# Altium schematic sheet RS485.SchDoc
size A4; Organization: Altium Limited; Address1: L3, 12a Rodborough Rd; Address2: Frenchs Forest; Address3: NSW; Address4: Australia 2086
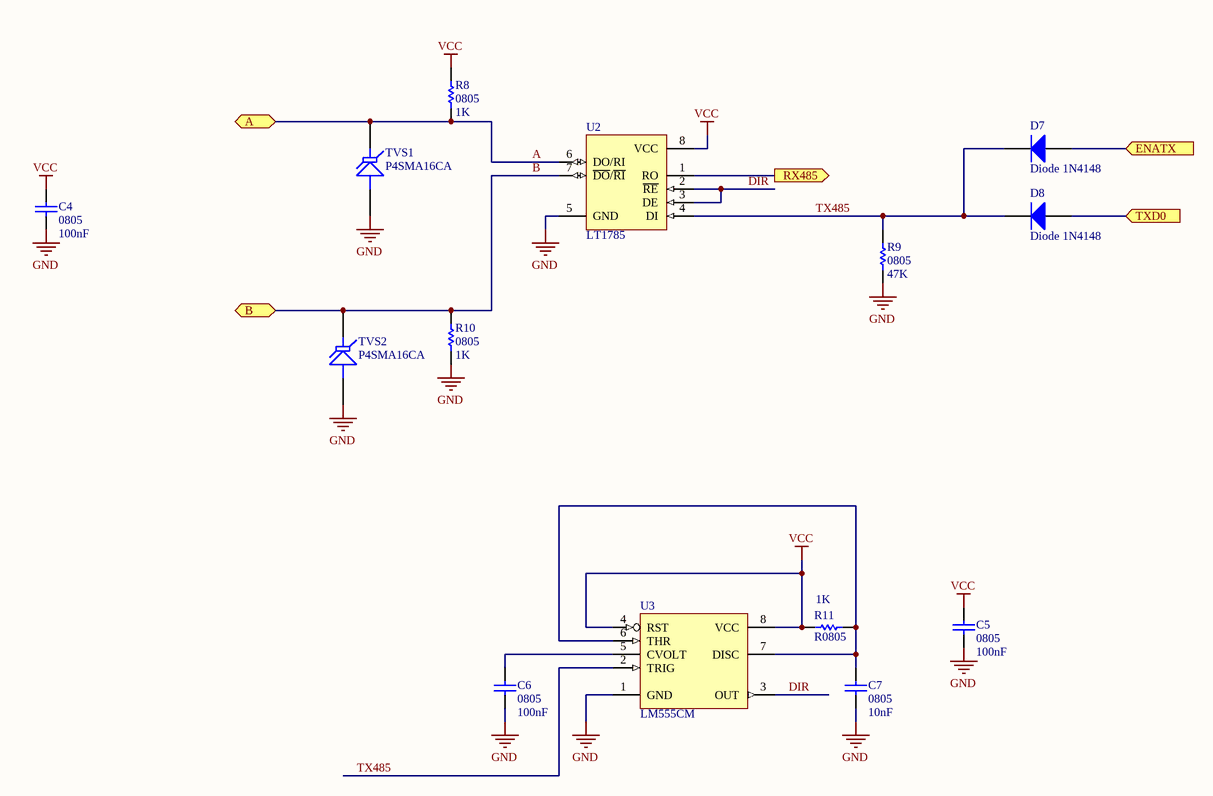
[diagram p0: RS485.SchDoc]

## Parts
C4  0805  value 100nF  [C0805C]
C5  0805  value 100nF  [C0805C]
C6  0805  value 100nF  [C0805C]
C7  0805  value 10nF  [C0805C]
D7  Diode 1N4148  [1N4148SMD]
D8  Diode 1N4148  [1N4148SMD]
R8  0805  value 1K  [R0805]
R9  0805  value 47K  [R0805]
R10  0805  value 1K  [R0805]
R11  R0805  value 1K  [R0805]
TVS1  P4SMA16CA  [TVS]
TVS2  P4SMA16CA  [TVS]
U2  LT1785  [M08A_N]
U3  LM555CM  [M08A_N]

## Ports
A (bidir), B (bidir), ENATX (in), RX485 (out), TXD0 (in)

## Nets
GND: C4.1 C5.1 C6.1 C7.1 R9.1 R10.1 TVS1.1(A) TVS2.1(A) U2.5(GND) U3.1(GND)
VCC: C4.2 C5.2 R8.2 R11.1 U2.8(VCC) U3.4(RST) U3.8(VCC)
A: R8.1 TVS1.2(K) U2.6(DO/RI) ; port A
B: R10.2 TVS2.2(K) U2.7(~{DO}/~{RI}) ; port B
DIR: U2.2(~{RE}) U2.3(DE) U3.3(OUT)
ENATX: D7.1(A) ; port ENATX
RX485: U2.1(RO) ; port RX485
TX485: D7.2(K) D8.2(K) R9.2 U2.4(DI) U3.2(TRIG)
TXD0: D8.1(A) ; port TXD0
NetC6_2: C6.2 U3.5(CVOLT)
NetC7_2: C7.2 R11.2 U3.6(THR) U3.7(DISC)

## Notes on the sheet
- Title
- Size:
- Date:
- A4
- Number:
- Time:
- Revision:
- Sheet
- of
- File:

## Library data of the parts
C4-C6 = Cap 0805: Cap 100nF 25V X7R; Part: 399-1170-1-ND; Proveedor: Digikey; Published: 8-Jun-2000; LatestRevisionDate: 17-Jul-2002; LatestRevisionNote: Re-released for DXP Platform.; PackageReference: C1206; Publisher: Altium Limited; Price: 0.05
C7 = Cap 0805 10nF: Cap 100nF 25V X7R; Part: 399-1158-1-ND; Proveedor: Digikey; Published: 8-Jun-2000; LatestRevisionDate: 17-Jul-2002; LatestRevisionNote: Re-released for DXP Platform.; PackageReference: C1206; Publisher: Altium Limited; Price: 0.1
D7 D8 = Diode 1N4148: 1N4148; Part: 1N4148WTPMSCT; Proveedor: Digikey; Published: 8-Jun-2000; LatestRevisionDate: 17-Jul-2002; LatestRevisionNote: Re-released for DXP Platform.; PackageVersion: Sep-1996; PackageReference: SMC; Publisher: Altium Limited; Code_JEDEC: DO-214-AB; Price: 0.202
R8 R10 = Res 0805 1K: Semiconductor Resistor; Part: 541-1.0KACT; Proveedor: Digikey; Published: 8-Jun-2000; LatestRevisionDate: 17-Jul-2002; LatestRevisionNote: Re-released for DXP Platform.; PackageReference: AXIAL-0.5; Publisher: Altium Limited; Price: 0.077
R9 = Res 0805 47K: Semiconductor Resistor; Part: 541-47KACT; Proveedor: Digikey; Published: 8-Jun-2000; LatestRevisionDate: 17-Jul-2002; LatestRevisionNote: Re-released for DXP Platform.; PackageReference: AXIAL-0.5; Publisher: Altium Limited; Price: 0.077
R11 = Res 0805 1K: Semiconductor Resistor; Part: 311-1.0KARCT-ND; Proveedor: Digikey; Published: 8-Jun-2000; LatestRevisionDate: 17-Jul-2002; LatestRevisionNote: Re-released for DXP Platform.; PackageReference: AXIAL-0.5; Publisher: Altium Limited; Price: 0.1
TVS1 TVS2 = Tranzorb: Part: P4SMA16CA-ND; Proveedor: Digikey; Published: 24-Mar-1999; LatestRevisionDate: 17-Jul-2002; LatestRevisionNote: Re-released for DXP Platform.; PackageReference: DO-7; Publisher: Altium Limited; Price: 0.27336
U2 = LT1785: IC TXRX RS485/RS422 60V 8-SOIC; Part: LT1785IS8#PBF; Proveedor: Digikey; Published: 15-Apr-2002; LatestRevisionDate: 06-Jun-2005; LatestRevisionNote: Stylized 3D Model Added.; DatasheetVersion: Jul-1998; PackageVersion: Sep-1997; PackageReference: N08E; Publisher: Altium Limited; PackageDescription: DIP; 8 Leads; Row Spacing 7.62 mm; Pitch 2.54 mm; ComponentLink1Description: Manufacturer Link; ComponentLink1URL: http://www.national.com/; ComponentLink2Description: Datasheet; ComponentLink2URL: http://www.national.com/ds.cgi/DS/DS75176B.pdf; ComponentLink3Description: URL Link1; ComponentLink3URL: http://www.national.com/pf/DS/DS75176B.html; Price: 4.77
U3 = LM555CM: Timer; Published: 15-Apr-2002; LatestRevisionDate: 13-Apr-2006; LatestRevisionNote: IPC-7351 Footprint Added.; DatasheetVersion: May-1997; PackageVersion: Sep-1997; PackageReference: M08A; Publisher: Altium Limited; PackageDescription: 8-Pin Small Outline Integrated Circuit 1.27 mm Pitch; Code_JEDEC: MS-012-AA; Code_IPC: SOIC127P600-8; ComponentLink1Description: Manufacturer Link; ComponentLink1URL: http://www.national.com/; ComponentLink2Description: Datasheet; ComponentLink2URL: http://www.national.com/ds.cgi/LM/LM555.pdf; ComponentLink3Description: URL Link1; ComponentLink3URL: http://www.national.com/pf/LM/LM555.html